# EAGLE design drive_ctrl (EAGLE 9.5.2)
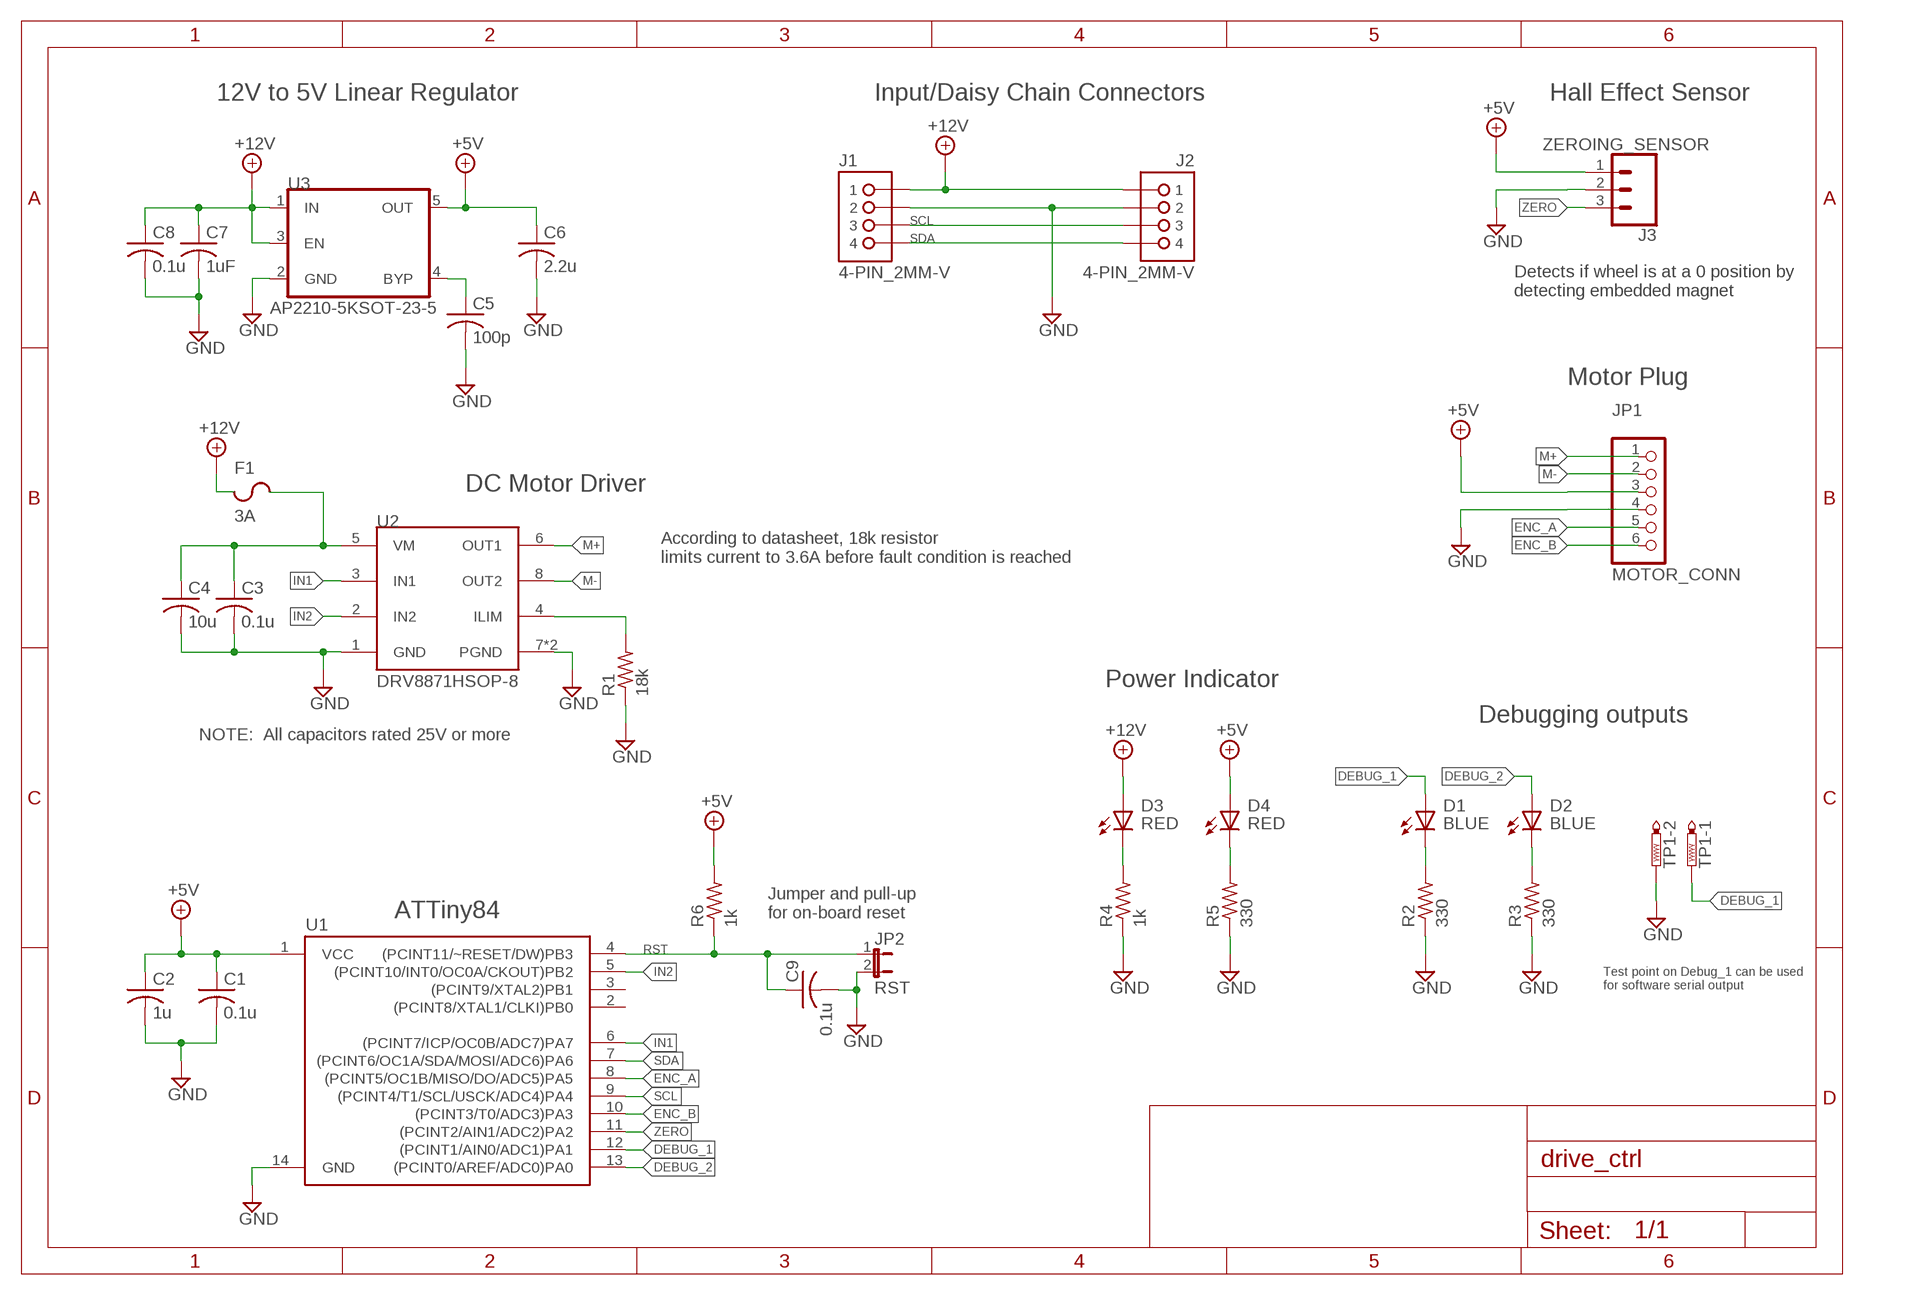
[diagram p0: schematic, sheet 1]

## Parts
C1  0.1u  C-USC0603  [C0603]
C2  1u  C-USC0603  [C0603]
C3  0.1u  C-USC0603  [C0603]
C4  10u  C-USC0603  [C0603]
C5  100p  C-USC0603  [C0603]
C6  2.2u  C-USC0603  [C0603]
C7  1uF  C-USC0603  [C0603]
C8  0.1u  C-USC0603  [C0603]
C9  0.1u  C-USC0603  [C0603]
D1  BLUE  LED-SMD-BLUE  [CHIP-LED0603]
D2  BLUE  LED-SMD-BLUE  [CHIP-LED0603]
D3  RED  LED-SMD-RED  [CHIP-LED0603]
D4  RED  LED-SMD-RED  [CHIP-LED0603]
F1  3A  CHIP_FUSE1206  [F1206]
J1  4-PIN_2MM-V  [2MM-4-V]
J2  4-PIN_2MM-V  [2MM-4-V]
J3  ZEROING_SENSOR  CONN_03  [1X03]
JP1  MOTOR_CONN  PINHD-1X6  [1X06]
JP2  RST  JP1E  [JP1]
R1  18k  R-US_R0603  [R0603]
R2  330  R-US_R0603  [R0603]
R3  330  R-US_R0603  [R0603]
R4  1k  R-US_R0603  [R0603]
R5  330  R-US_R0603  [R0603]
R6  1k  R-US_R0603  [R0603]
TP1  PTR2  [P2-38-17]
U1  ATTINY84ATTINY84-20PU  [DIP14]
U2  DRV8871HSOP-8  [SOIC127P600X170-9T240X310N]
U3  AP2210-5KSOT-23-5  [SOT95P282X145-5N]

## Nets
12V_FUSE: C3.1 C4.1 F1.2 U2.5(VM)
+5V: C1.1 C2.1 C6.1 D4.A J3.1 JP1.3 R6.2 U1.1(VCC) U3.5(OUT)
+12V: C7.1 C8.1 D3.A F1.1 J1.1 J2.1 U3.1(IN) U3.3(EN)
BYP: C5.1 U3.4(BYP)
DEBUG_1: D1.A TP1.TP-1 U1.12((PCINT1/AIN0/ADC1)PA1)
DEBUG_2: D2.A U1.13((PCINT0/AREF/ADC0)PA0)
ENC_A: JP1.5 U1.8((PCINT5/OC1B/MISO/DO/ADC5)PA5)
ENC_B: JP1.6 U1.10((PCINT3/T0/ADC3)PA3)
GND: C1.2 C2.2 C3.2 C4.2 C5.2 C6.2 C7.2 C8.2 C9.2 J1.2 J2.2 J3.2 JP1.4 JP2.2 R1.1 R2.1 R3.1 R4.1 R5.1 TP1.TP-2 U1.14(GND) U2.1(GND) U2.7(PGND) U2.9(PGND) U3.2(GND)
ILIM: R1.2 U2.4(ILIM)
IN1: U1.6((PCINT7/ICP/OC0B/ADC7)PA7) U2.3(IN1)
IN2: U1.5((PCINT10/INT0/OC0A/CKOUT)PB2) U2.2(IN2)
M+: JP1.1 U2.6(OUT1)
M-: JP1.2 U2.8(OUT2)
N$1: D1.C(K) R2.2
N$2: D3.C(K) R4.2
N$3: D2.C(K) R3.2
N$4: D4.C(K) R5.2
RST: C9.1 JP2.1 R6.1 U1.4((PCINT11/~RESET/DW)PB3)
SCL: J1.3 J2.3 U1.9((PCINT4/T1/SCL/USCK/ADC4)PA4)
SDA: J1.4 J2.4 U1.7((PCINT6/OC1A/SDA/MOSI/ADC6)PA6)
ZERO: J3.3 U1.11((PCINT2/AIN1/ADC2)PA2)
Unconnected: U1.2((PCINT8/XTAL1/CLKI)PB0) U1.3((PCINT9/XTAL2)PB1)

## Notes on the sheet
- 12V to 5V Linear Regulator | Input/Daisy Chain Connectors | Hall Effect Sensor
- Detects if wheel is at a 0 position by 
  detecting embedded magnet
- Motor Plug
- DC Motor Driver
- According to datasheet, 18k resistor
  limits current to 3.6A before fault condition is reached
- Power Indicator
- Debugging outputs
- NOTE:  All capacitors rated 25V or more
- ATTiny84
- Jumper and pull-up 
  for on-board reset
- Test point on Debug_1 can be used 
  for software serial output

## Library data of the parts
C1-C9 = rcl:C-US: CAPACITOR, American symbol; SPICEPREFIX: C
D1 D2 = RoboJackets-LEDs:LED-SMD; DIGIKEY: 160-1647-1-ND; MPN: LTST-C191TBKT
D3 D4 = RoboJackets-LEDs:LED-SMD; DIGIKEY: 160-1447-1-ND; MPN: LTST-C191KRKT
F1 = RoboJackets-Fuses:CHIP_FUSE
J1 J2 = drive_ctrl:4-PIN_2MM-*: MPN: 0353630460; PINS: 4; PIN_PITCH: 2.0 mm
J3 = SparkFun-Connectors:CONN_03: Multi connection point. Often used as Generic Header-pin footprint for 0.1 inch spaced/style header connections On any of the 0.1 inch spaced packages, you can populate with these: Break Away Headers - Straight <https://www.sparkfun.com/products/116> (PRT-00116) Break Away Male Headers - Right Angle <https://www.sparkfun.com/products/553> (PRT-00553) Female Headers <https://www.sparkfun.com/products/115> (PRT-00115) Break Away Headers - Machine Pin <https://www.sparkfun.com/products/117> (PRT-00117) Break Away Female Headers - Swiss Machine Pin <https://www.sparkfun.com/products/743> (PRT-00743) Stackable Header - 3 Pin (Female, 0.1") <https://www.sparkfun.com/products/13875> (PRT-13875) For SCREWTERMINALS and SPRING TERMINALS visit here: Screw Terimnals on SparkFun.com <https://www.sparkfun.com/search/results?term=Screw+Terminals> (5mm/3.5mm/2.54mm spacing) This device is also useful as a general connection point to wire up your design to another part of your project. Our various solder wires solder well into these plated through hole pads. Hook-Up Wire - Assortment (Stranded, 22 AWG) <https://www.sparkfun.com/products/11375> (PRT-11375) Hook-Up Wire - Assortment (Solid Core, 22 AWG) <https://www.sparkfun.com/products/11367> (PRT-11367) View the entire wire category on our website here <https://www.sparkfun.com/categories/141> Special notes: Molex polarized connector foot print use with SKU : PRT-08232 with associated crimp pins and housings.
JP1 = pinhead:PINHD-1X6: PIN HEADER
JP2 = jumper:JP1E: JUMPER
R1-R6 = rcl:R-US_: RESISTOR, American symbol; SPICEPREFIX: R
TP1 = testpad:PTR2: TEST PIN
U1 = SparkFun-IC-Microcontroller:ATTINY84: Atmel 14-pin 2/4/8kB flash uC Datasheet <https://cdn.sparkfun.com/datasheets/Widgets/doc8006.pdf> SparkFun Products Tiny AVR Programmer <https://www.sparkfun.com/products/11801> (PGM-11801) SparkFun Servo Trigger - Continuous Rotation <https://www.sparkfun.com/products/13872> (WIG-13872) SparkFun Servo Trigger <https://www.sparkfun.com/products/13118> (WIG-13118)
U2 = drive_ctrl:DRV8871
U3 = drive_ctrl:AP2210-5K

## Net classes
0 default: width 0.2 mm
1 PWR: width 0.6 mm

## Board
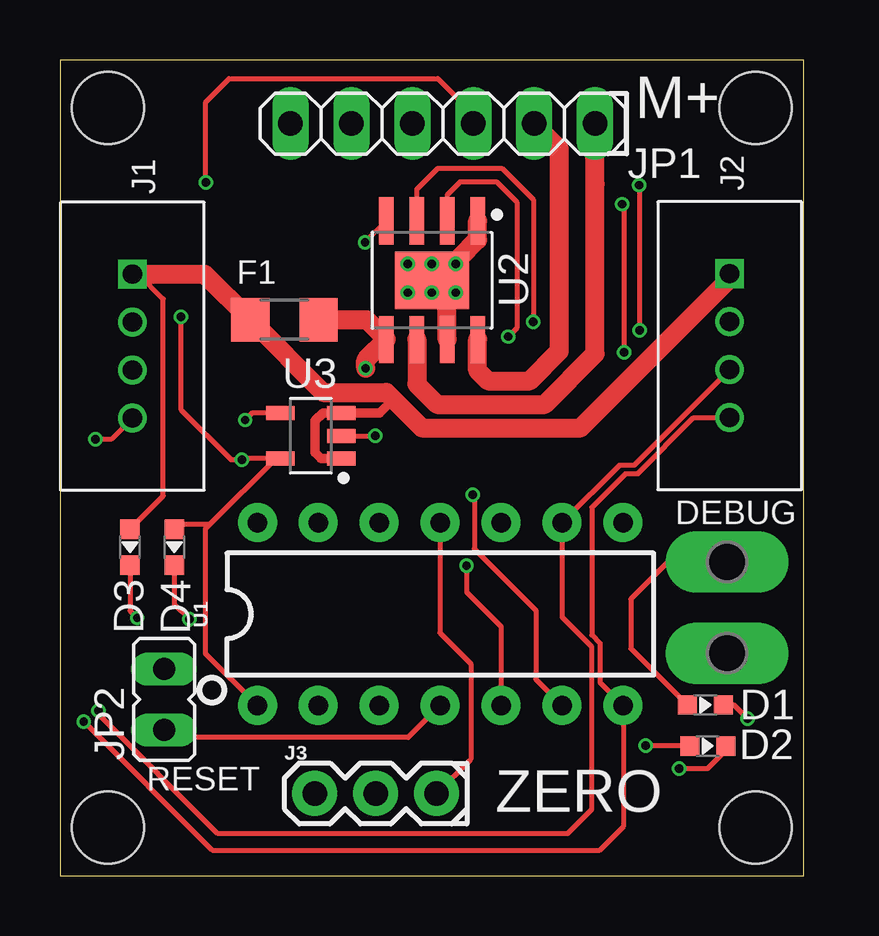
[diagram p1: board, top side]
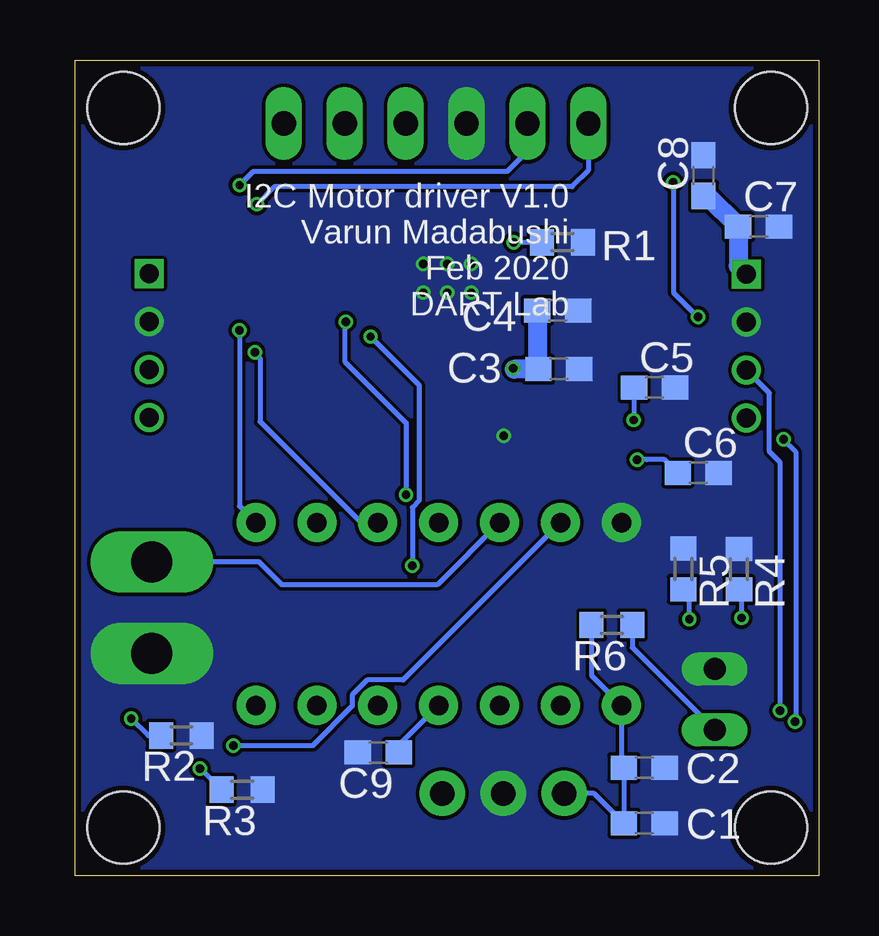
[diagram p2: board, bottom side, seen from below]

Size 31 x 34 mm. Coordinates in mm from the lower left corner, seen from the top.
Outline: 0,0 31,0 31,34 0,34 0,0
Copper layers (1*16): Top 0.018mm / dielectric 1.55mm / Bottom 0.018mm
Design rules "eC_2Layer_PClass6_BaseCopperO18_eCDefault": minimum track width 0.15mm, minimum drill 0.35mm, track to track 0.15mm, track to pad 0.15mm, pad to pad 0.15mm, via to via 0.15mm, smd to smd 0mil, copper to edge 0.25mm, drill to drill 0.35mm, minimum pad ring 0.175mm, minimum via ring 0.125mm, stop-mask expansion 0mil, vias tented up to drill 0.45mm, thermal gap 0.2mm
Holes 3 mm at 2,32 29,32 29,2 2,2

### Footprints (pad centres in the part's own frame; a part is rotated, then mirrored left to right if it is on the bottom)
C0603 = smd 1.1 x 1: 1 -0.85,0; 2 0.85,0
CHIP-LED0603 = smd 0.8 x 0.8: A 0,-0.75; C 0,0.75
F1206 = smd 1.6 x 1.803: 1 -1.422,0; 2 1.422,0
2MM-4-V = drill 0.8 square: 1 -2,0 | drill 0.8: 2 0,0; 3 2,0; 4 4,0
1X03 = drill 1.016 pad 1.88: 1 0,0; 2 2.54,0; 3 5.08,0
1X06 = drill 1.016 long: 1 -6.35,0; 2 -3.81,0; 3 -1.27,0; 4 1.27,0; 5 3.81,0; 6 6.35,0
JP1 = drill 0.914 long: 1 0,-1.27; 2 0,1.27
R0603 = smd 1 x 1.1: 1 -0.85,0; 2 0.85,0
P2-38-17 = drill 1.702 pad 2.121 long: TP-1 -1.905,0; TP-2 1.905,0
DIP14 = drill 0.813 pad 1.626: 1 -7.62,-3.81; 2 -5.08,-3.81; 3 -2.54,-3.81; 4 0,-3.81; 5 2.54,-3.81; 6 5.08,-3.81; 7 7.62,-3.81; 8 7.62,3.81; 9 5.08,3.81; 10 2.54,3.81; 11 0,3.81; 12 -2.54,3.81; 13 -5.08,3.81; 14 -7.62,3.81
SOIC127P600X170-9T240X310N = smd 1.968 x 0.599: 1 -2.473,1.905; 2 -2.473,0.635; 3 -2.473,-0.635; 4 -2.473,-1.905; 5 2.473,-1.905; 6 2.473,-0.635; 7 2.473,0.635; 8 2.473,1.905 | smd 2.4 x 3.1: 9 0,0
SOT95P282X145-5N = smd 1.189 x 0.589: 1 -1.264,0.95; 2 -1.264,0; 3 -1.264,-0.95; 4 1.264,-0.95; 5 1.264,0.95

### Placement (x,y rotation side)
C1  7.28,2.18 0 bottom
C2  7.28,4.5 0 bottom
C3  10.84,21.11 0 bottom
C4  10.89,23.56 0 bottom
C5  6.85,20.34 0 bottom
C6  5.03,16.79 0 bottom
C7  2.51,27.05 0 bottom
C8  4.81,29.18 90 bottom
C9  18.37,5.13 180 bottom
D1  26.91,7.11 270 top
D2  27,5.4 270 top
D3  2.92,13.69 180 top
D4  4.77,13.69 180 top
F1  9.36,23.17 0 top
J1  3.02,23.07 270 top
J2  27.92,23.09 270 top
J3  10.62,3.42 0 top
JP1  15.96,31.35 180 top
JP2  4.34,7.34 0 top
R1  10.69,26.4 180 bottom
R2  26.58,5.84 180 bottom
R3  24.05,3.58 180 bottom
R4  3.33,12.77 270 bottom
R5  5.65,12.78 270 bottom
R6  8.63,10.45 180 bottom
TP1  27.81,11.17 270 top
U1  15.85,10.9 0 top
U2  15.51,24.82 270 top
U3  10.46,18.33 180 top

### Tracks (layer width: path | path; a pad name or v marks a point on that pad's centre or on a via)
12V_FUSE  (via drill 0.35)
  Top 0.8: v12.74,21.15 12.74,21.48 U2.5 12.78,23.17 F1.2
  Bottom 0.4: 12.7,21.11 v12.74,21.15 | 11.74,21.16 C3.1
  Bottom 0.8: C3.1 12.7,21.11 | C4.1 11.74,21.16
+5V  (via drill 0.35)
  Top 0.2: v6.08,28.9 6.08,32.25 7.05,33.22 15.75,33.22 17.23,31.74 JP1.3 | U1.1 6.06,9.26 6.06,14.45 6.26,14.65 | 6.26,14.65 8.98,17.37 U3.5 7.62,17.38 v7.58,17.34 7.13,17.34 5.04,19.43 v5.04,23.29 | D4.A 4.98,14.65 6.26,14.65
  Bottom 0.2: J3.1 9.37,3.42 C1.1 C2.1 8.23,4.6 U1.1 9.48,8.34 R6.2 | v6.08,28.9 6.06,28.88 6.06,24.31 v5.04,23.29 | 7.19,17.34 7.48,17.34 | 7.48,17.34 v7.58,17.34 | C6.1 6.43,17.34 7.48,17.34
+12V
  Top 0.2: D3.A 4.31,15.83 4.31,24.04 3.28,25.07
  Top 0.4: 13.9,19.85 13.33,19.28 U3.3 10.96,19.28 10.64,18.96 10.64,17.63 10.89,17.38 U3.1
  Top 0.8: 3.28,25.07 J1.1 6.04,25.07 F1.1 10.96,20.14 13.61,20.14 13.9,19.85 15.09,18.66 21.7,18.66 27.92,24.88 J2.1
  Bottom 0.8: J1.1 3.36,25.41 C7.1 4.64,28.33 C8.1
BYP  (via drill 0.35)
  Top 0.2: U3.4 8.01,19.28 v7.72,18.99
  Bottom 0.2: v7.72,18.99 7.7,19.01 C5.1
DEBUG_1
  Top 0.2: TP1.TP-1 25.35,13.07 23.8,11.53 23.8,9.46 D1.A
  Bottom 0.2: TP1.TP-1 23.34,13.07 22.38,12.12 15.9,12.12 U1.12
DEBUG_2  (via drill 0.35)
  Top 0.2: v24.41,5.41 v24.42,5.4 D2.A
  Bottom 0.2: U1.13 17.33,8.15 18.83,8.15 19.45,7.53 19.45,7.06 21.11,5.41 v24.41,5.41
ENC_A  (via drill 0.35)
  Top 0.2: v24.15,28.78 v24.15,22.74 v24.16,22.73
  Bottom 0.2: JP1.5 12.15,30.2 13,29.35 23.58,29.35 v24.15,28.78 24.04,28.89 | U1.8 24.16,15.4 v24.16,22.73
ENC_B  (via drill 0.35)
  Top 0.2: v23.43,27.99 23.52,27.9 v23.52,21.81
  Bottom 0.2: JP1.6 9.61,29.39 10.29,28.71 22.71,28.71 v23.43,27.99 | U1.10 19.09,14.71 23.3,18.92 23.3,21.59 v23.52,21.81
GND  (via drill 0.35)
  Top 0.2: U3.2 v13.14,18.33 | v16.5,25.5 16.19,25.5 U2.9 16.45,25.76 16.67,25.76
  Top 0.8: U2.7 16.14,23.95 v16.5,24.3 | 16.67,25.76 17.41,26.5 U2.1
  other vias: 14.5,25.5 15.5,25.5 14.5,24.3 15.5,24.3
  pour Bottom (no thermals): 0,0 0,33.97 31,33.97 31,0
ILIM  (via drill 0.35)
  Top 0.2: U2.4 v12.72,26.4
  Bottom 0.2: v12.72,26.4 R1.2
IN1  (via drill 0.35)
  Top 0.2: U2.3 14.88,28.61 15.75,29.48 18.42,29.48 19.73,28.17 v19.73,23.08 | v17.21,15.87 17.28,15.8 17.28,13.62 19.84,11.06 19.84,8.18 U1.6
  Bottom 0.2: v19.73,23.08 19.77,23.04 19.77,21.43 17.21,18.87 v17.21,15.87
IN2  (via drill 0.35)
  Top 0.2: v18.69,22.47 19.05,22.83 19.05,28.07 18.2,28.92 16.69,28.92 16.14,28.38 U2.2 | v16.95,12.91 16.95,11.82 18.39,10.38 U1.5
  Bottom 0.2: v16.95,12.91 16.95,15.35 16.66,15.64 16.66,20.44 v18.69,22.47
M+
  Top 0.4: 14.88,20.5 14.87,20.5
  Top 0.8: U2.6 14.88,20.5 | 14.87,20.5 15.73,19.64 20.21,19.64 22.31,21.74 22.31,28.83 JP1.1
M-
  Top 0.8: JP1.2 20.81,30.31 20.81,21.85 19.59,20.62 17.85,20.62 17.41,21.06 U2.8
N$1  (via drill 0.35)
  Top 0.2: v28.67,6.54 28.1,7.11 D1.C
  Bottom 0.2: R2.2 27.97,5.84 v28.67,6.54
N$2  (via drill 0.35)
  Top 0.2: D3.C 2.92,11.04 v3.22,10.74
  Bottom 0.2: v3.22,10.74 3.22,11.81 R4.2
N$3  (via drill 0.35)
  Top 0.2: D2.C 27.75,5.21 26.99,4.45 v25.81,4.45
  Bottom 0.2: R3.2 25.74,4.42 25.81,4.42 v25.81,4.45
N$4  (via drill 0.35)
  Top 0.2: D4.C 4.77,11.32 v5.4,10.69
  Bottom 0.2: v5.4,10.69 5.4,11.68 R5.2
RST
  Top 0.2: U1.4 14.52,5.76 4.65,5.76 JP2.1
  Bottom 0.2: R6.1 7.78,9.51 JP2.1 | U1.4 17.52,5.42 C9.1
SCL  (via drill 0.35)
  Top 0.2: J2.3 23.93,17.1 23.32,17.1 U1.9 20.93,10.78 22.16,9.54 22.16,2.74 21.16,1.74 6.58,1.74 1.61,6.71 v1.61,6.88
  Bottom 0.2: J1.3 2.06,20.11 2.06,17.67 1.61,17.22 v1.61,6.88
SDA  (via drill 0.35)
  Top 0.2: J1.4 2.13,18.18 v1.48,18.18 | v0.99,6.41 v1,6.41 6.35,1.06 22.5,1.06 23.5,2.06 23.5,7.06 U1.7 22.51,8.05 22.51,9.69 22.17,10.03 22.17,15.35 23.57,16.75 24.07,16.75 26.41,19.09 J2.4
  Bottom 0.2: v1.48,18.18 0.97,17.67 0.97,6.43 v0.99,6.41
ZERO
  Top 0.2: U1.11 15.84,10.12 17.13,8.83 17.13,4.85 J3.3

### Text on the board
tPlace: M+ | DEBUG | RESET | ZERO
bPlace: I2C Motor driver V1.0 / Varun Madabushi / Feb 2020 / DART Lab